# EAGLE design pic_can_switch (EAGLE 6.5.0)
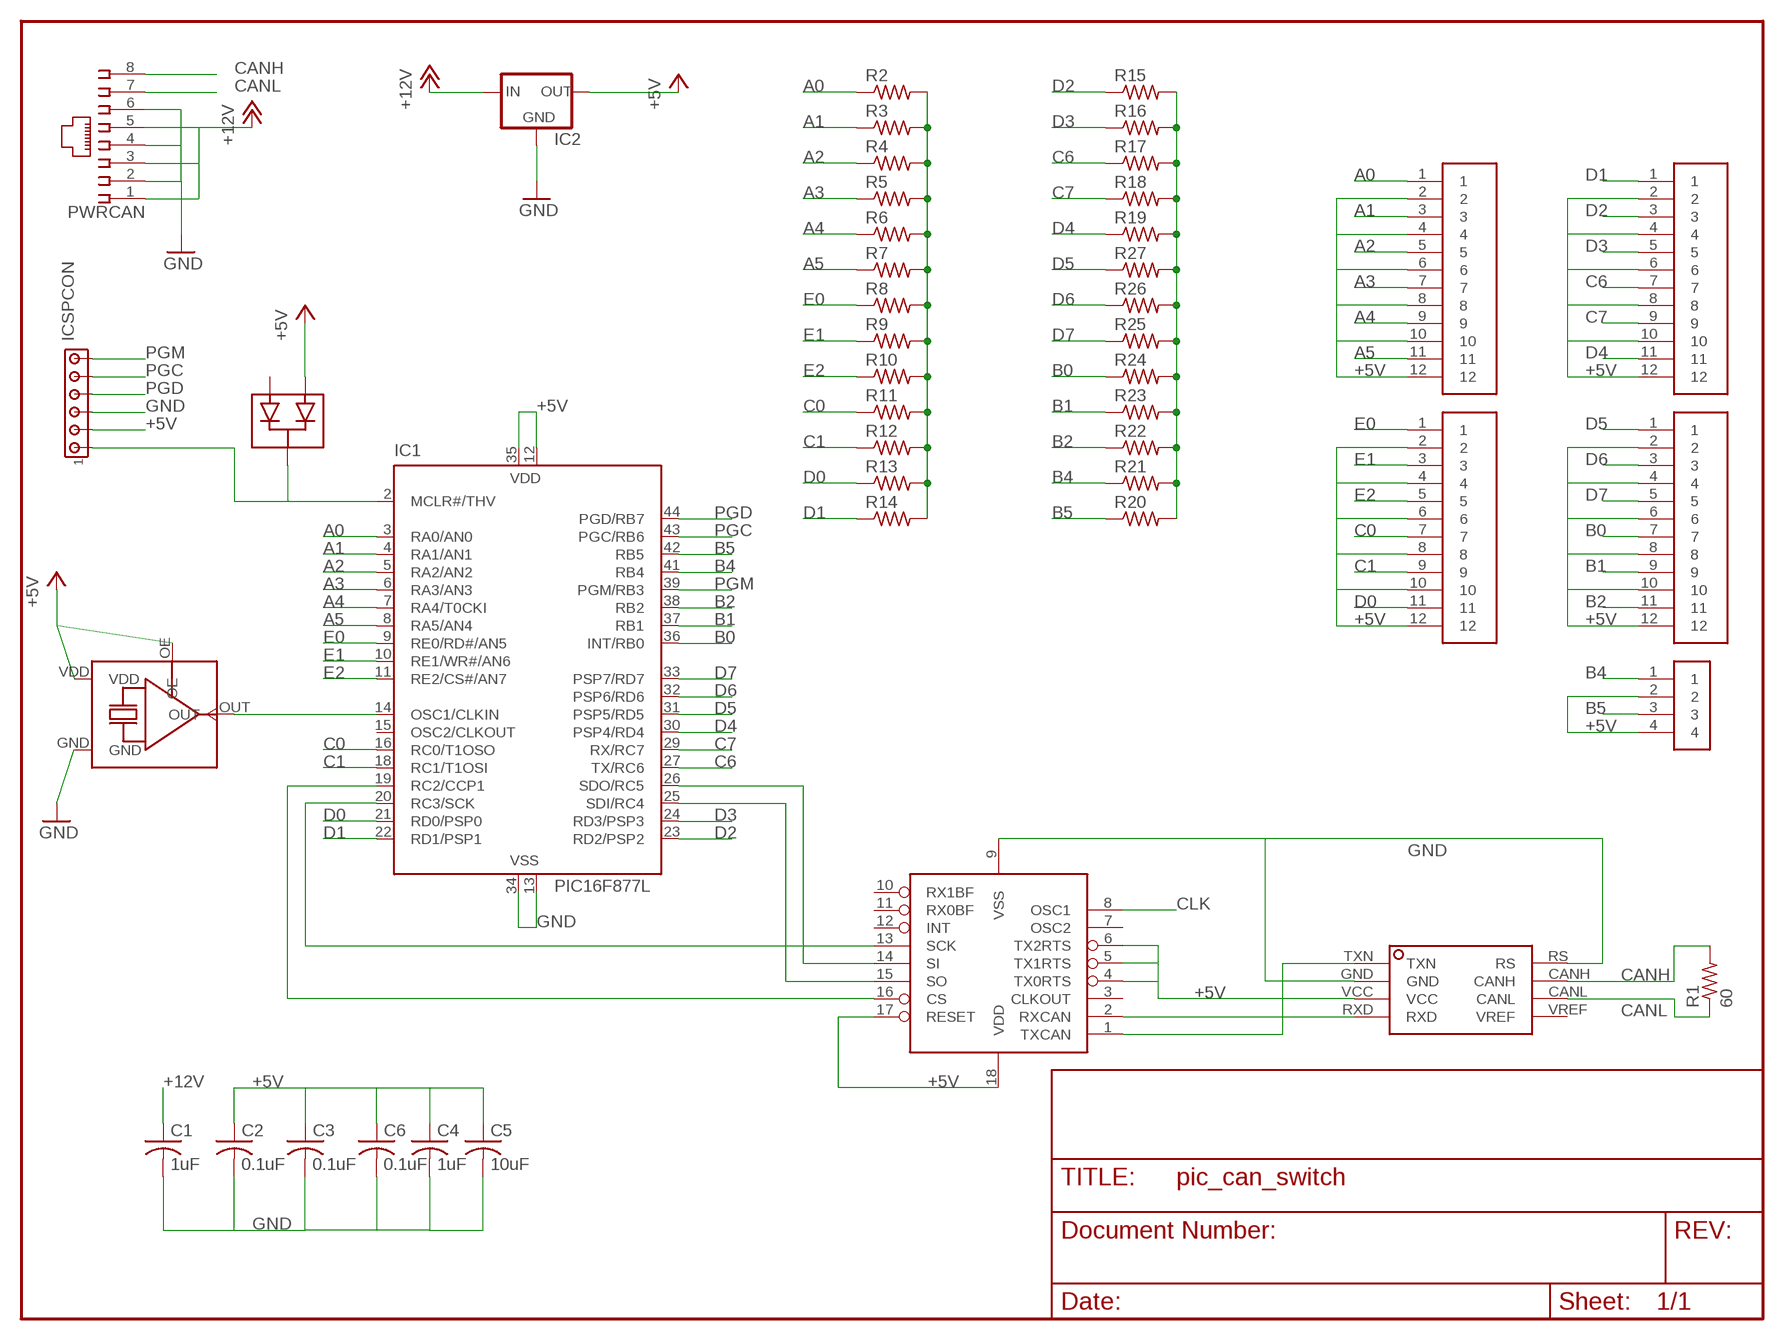
[diagram p0: schematic, sheet 1]

## Parts
C1  1uF  C-USC1206  [C1206]
C2  0.1uF  C-USC0805  [C0805]
C3  0.1uF  C-USC0805  [C0805]
C4  1uF  C-USC1206  [C1206]
C5  10uF  C-USC1210  [C1210]
C6  0.1uF  C-USC0805  [C0805]
IC1  PIC16F877L  [PLCC-44]
IC2  78XXL  [78XXL]
IC3  UC5350D  [SOIC8]
ICSPCON  MTA06-100  [10X06MTA]
MCP1  MCP2510-I/SO  [SO-18W]
PWRCAN  555764-1  [555764-1]
R1  60  R-US_R0805  [R0805]
R2  R-US_R0805  [R0805]
R3  R-US_R0805  [R0805]
R4  R-US_R0805  [R0805]
R5  R-US_R0805  [R0805]
R6  R-US_R0805  [R0805]
R7  R-US_R0805  [R0805]
R8  R-US_R0805  [R0805]
R9  R-US_R0805  [R0805]
R10  R-US_R0805  [R0805]
R11  R-US_R0805  [R0805]
R12  R-US_R0805  [R0805]
R13  R-US_R0805  [R0805]
R14  R-US_R0805  [R0805]
R15  R-US_R0805  [R0805]
R16  R-US_R0805  [R0805]
R17  R-US_R0805  [R0805]
R18  R-US_R0805  [R0805]
R19  R-US_R0805  [R0805]
R20  R-US_R0805  [R0805]
R21  R-US_R0805  [R0805]
R22  R-US_R0805  [R0805]
R23  R-US_R0805  [R0805]
R24  R-US_R0805  [R0805]
R25  R-US_R0805  [R0805]
R26  R-US_R0805  [R0805]
R27  R-US_R0805  [R0805]
TB1  MPT0.5/12-2.54  [MPT0.5/12-2.54]
TB2  MPT0.5/12-2.54  [MPT0.5/12-2.54]
TB3  MPT0.5/12-2.54  [MPT0.5/12-2.54]
TB4  MPT0.5/12-2.54  [MPT0.5/12-2.54]
TB5  MPT0.5/4-2.54"  [MPT0.5/4-2.54]
U$1  SG-615P  [SG-615]
U$2  BAV70_  [SOT-23]

## Nets
+5V: C2.1 C3.1 C4.1 C5.1 C6.1 IC1.12(VDD) IC1.35(VDD) IC2.OUT IC3.VCC ICSPCON.5 MCP1.4(TX0RTS) MCP1.5(TX1RTS) MCP1.6(TX2RTS) MCP1.17(RESET) MCP1.18(VDD) TB1.2 TB1.4 TB1.6 TB1.8 TB1.10 TB1.12 TB2.2 TB2.4 TB2.6 TB2.8 TB2.10 TB2.12 TB3.2 TB3.4 TB3.6 TB3.8 TB3.10 TB3.12 TB4.2 TB4.4 TB4.6 TB4.8 TB4.10 TB4.12 TB5.2 TB5.4 U$1.OE U$1.VDD U$2.1(A1)
+12V: C1.1 IC2.IN PWRCAN.1 PWRCAN.3 PWRCAN.5
A0: IC1.3(RA0/AN0) R2.1 TB1.1
A1: IC1.4(RA1/AN1) R3.1 TB1.3
A2: IC1.5(RA2/AN2) R4.1 TB1.5
A3: IC1.6(RA3/AN3) R5.1 TB1.7
A4: IC1.7(RA4/T0CKI) R6.1 TB1.9
A5: IC1.8(RA5/AN4) R7.1 TB1.11
B0: IC1.36(INT/RB0) R24.1 TB4.7
B1: IC1.37(RB1) R23.1 TB4.9
B2: IC1.38(RB2) R22.1 TB4.11
B4: IC1.41(RB4) R21.1 TB5.1
B5: IC1.42(RB5) R20.1 TB5.3
C0: IC1.16(RC0/T1OSO) R11.1 TB2.7
C1: IC1.18(RC1/T1OSI) R12.1 TB2.9
C6: IC1.27(TX/RC6) R17.1 TB3.7
C7: IC1.29(RX/RC7) R18.1 TB3.9
CANH: IC3.CANH PWRCAN.8 R1.2
CANL: IC3.CANL PWRCAN.7 R1.1
CLK: IC1.14(OSC1/CLKIN) MCP1.8(OSC1) U$1.OUT
D0: IC1.21(RD0/PSP0) R13.1 TB2.11
D1: IC1.22(RD1/PSP1) R14.1 TB3.1
D2: IC1.23(RD2/PSP2) R15.1 TB3.3
D3: IC1.24(RD3/PSP3) R16.1 TB3.5
D4: IC1.30(PSP4/RD4) R19.1 TB3.11
D5: IC1.31(PSP5/RD5) R27.1 TB4.1
D6: IC1.32(PSP6/RD6) R26.1 TB4.3
D7: IC1.33(PSP7/RD7) R25.1 TB4.5
E0: IC1.9(RE0/RD#/AN5) R8.1 TB2.1
E1: IC1.10(RE1/WR#/AN6) R9.1 TB2.3
E2: IC1.11(RE2/CS#/AN7) R10.1 TB2.5
GND: C1.2 C2.2 C3.2 C4.2 C5.2 C6.2 IC1.13(VSS) IC1.34(VSS) IC2.GND IC3.GND IC3.RS ICSPCON.4 MCP1.9(VSS) PWRCAN.2 PWRCAN.4 PWRCAN.6 R2.2 R3.2 R4.2 R5.2 R6.2 R7.2 R8.2 R9.2 R10.2 R11.2 R12.2 R13.2 R14.2 R15.2 R16.2 R17.2 R18.2 R19.2 R20.2 R21.2 R22.2 R23.2 R24.2 R25.2 R26.2 R27.2 U$1.GND
N$3: IC1.25(SDI/RC4) MCP1.15(SO)
N$4: IC1.26(SDO/RC5) MCP1.14(SI)
N$5: IC1.20(RC3/SCK) MCP1.13(SCK)
N$6: IC1.2(MCLR#/THV) ICSPCON.6 U$2.3(C)
N$7: IC3.TXN MCP1.1(TXCAN)
N$8: IC3.RXD MCP1.2(RXCAN)
N$12: IC1.19(RC2/CCP1) MCP1.16(CS)
PGC: IC1.43(PGC/RB6) ICSPCON.2
PGD: IC1.44(PGD/RB7) ICSPCON.3
PGM: IC1.39(PGM/RB3) ICSPCON.1
Unconnected: IC1.15(OSC2/CLKOUT) IC3.VREF MCP1.3(CLKOUT) MCP1.7(OSC2) MCP1.10(RX1BF) MCP1.11(RX0BF) MCP1.12(INT) U$2.2(A2)

## Library data of the parts
C1-C6 = rcl:C-US: CAPACITOR, American symbol
IC1 = microchip:PIC16F87*: MICROCONTROLLER
IC2 = v-reg:78XXL: VOLTAGE REGULATOR
IC3 = house:UC5350: CAN Tranceiver
ICSPCON = con-amp:MTA06-100: AMP CONNECTOR
MCP1 = microchip:MCP2510
PWRCAN = con-amp:555764-1: AMP CONNECTOR
R1-R27 = rcl:R-US_: RESISTOR, American symbol
TB1-TB4 = house:MPT0.5: Pheonix Contact Micro-Pitch Terminal Block
TB5 = house:MPT0.5/4-2.54: Pheonix Contact Micro-Pitch Terminal Block
U$1 = house:SG-615: Epson Electronics CMOS/TTL SMD Oscillator
U$2 = house:BAV70: Fairchild Semiconductor Small Signal, Dual, Common Cathode, SOT-23 Diode

## Board
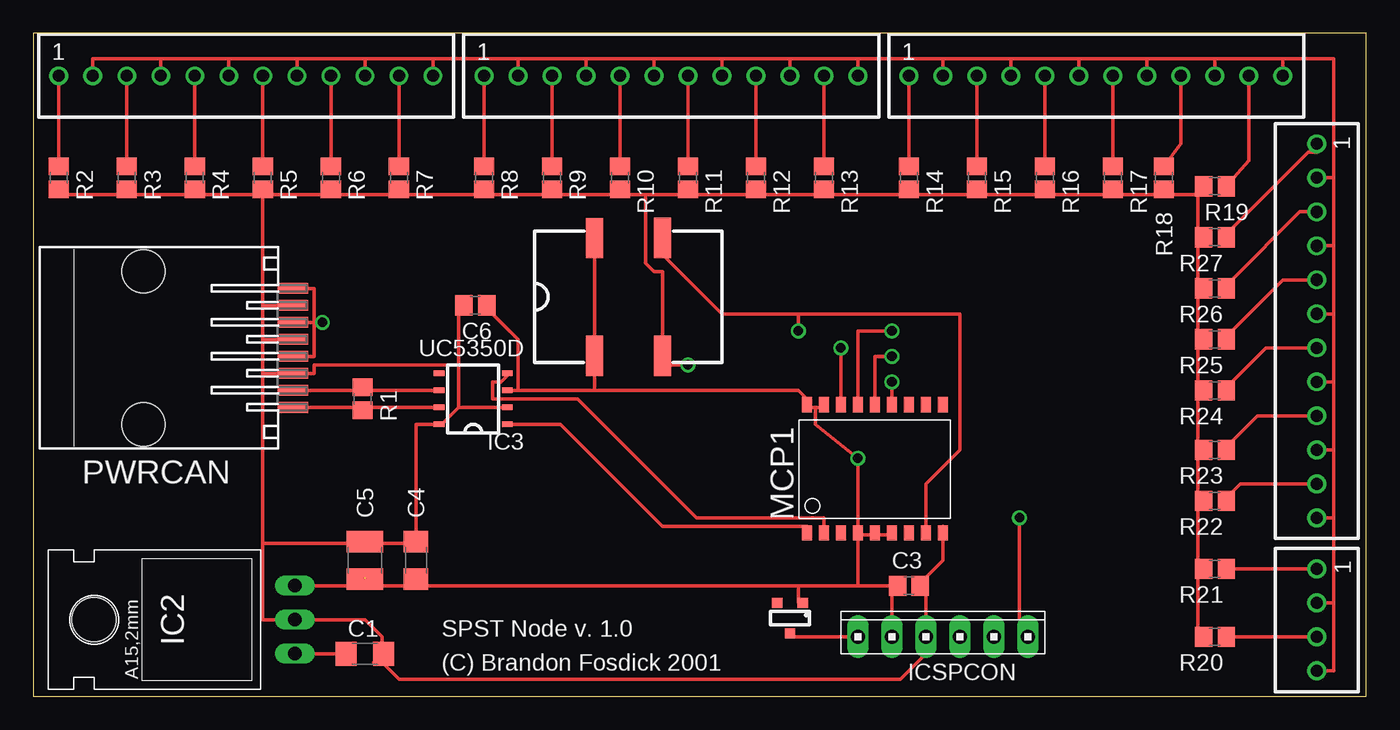
[diagram p1: board, top side]
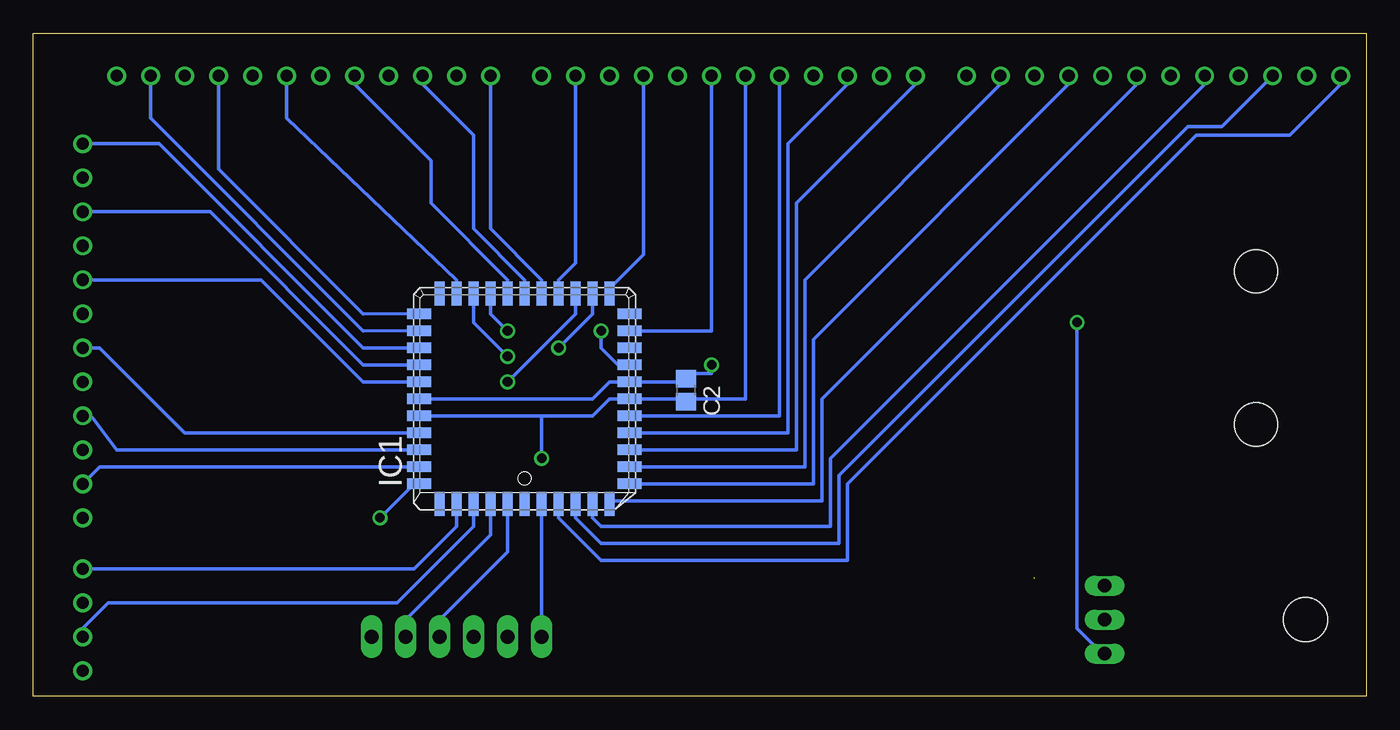
[diagram p2: board, bottom side, seen from below]

Size 99.55 x 49.55 mm. Coordinates in mm from the lower left corner, seen from the top.
Outline: 0,0 99.55,0 99.55,49.55 0,49.55 0,0
Copper layers (1*16): Top 0.035mm / dielectric 1.5mm / Bottom 0.035mm
Design rules "default": minimum track width 10mil, minimum drill 24mil, track to track 8mil, track to pad 8mil, pad to pad 8mil, via to via 8mil, smd to smd 8mil, copper to edge 40mil, drill to drill 8mil, minimum pad ring 10mil, minimum via ring 8mil, stop-mask expansion 0mil, vias tented up to drill 0mil, thermal gap 10mil

### Footprints (pad centres in the part's own frame; a part is rotated, then mirrored left to right if it is on the bottom)
C1206 = smd 1.6 x 1.8: 1 -1.4,0; 2 1.4,0
C0805 = smd 1.3 x 1.5: 1 -0.85,0; 2 0.85,0
C1210 = smd 1.6 x 2.7: 1 -1.4,0; 2 1.4,0
PLCC-44 = smd 1.8 x 0.76: 1 -7.86,0; 2 -7.86,-1.27; 3 -7.86,-2.54; 4 -7.86,-3.81; 5 -7.86,-5.08; 6 -7.86,-6.35; 18 7.86,-6.35; 19 7.86,-5.08; 20 7.86,-3.81; 21 7.86,-2.54; 22 7.86,-1.27; 23 7.86,0; 24 7.86,1.27; 25 7.86,2.54; 26 7.86,3.81; 27 7.86,5.08; 28 7.86,6.35; 40 -7.86,6.35; 41 -7.86,5.08; 42 -7.86,3.81; 43 -7.86,2.54; 44 -7.86,1.27 | smd 0.76 x 1.8: 7 -6.35,-7.86; 8 -5.08,-7.86; 9 -3.81,-7.86; 10 -2.54,-7.86; 11 -1.27,-7.86; 12 0,-7.86; 13 1.27,-7.86; 14 2.54,-7.86; 15 3.81,-7.86; 16 5.08,-7.86; 17 6.35,-7.86; 29 6.35,7.86; 30 5.08,7.86; 31 3.81,7.86; 32 2.54,7.86; 33 1.27,7.86; 34 0,7.86; 35 -1.27,7.86; 36 -2.54,7.86; 37 -3.81,7.86; 38 -5.08,7.86; 39 -6.35,7.86
78XXL = drill 1 long: GND 0,-3.81; IN -2.54,-3.81; OUT 2.54,-3.81 | hole 3.302: 0,11.176
SOIC8 = smd 0.813 x 0.406: CANH 2.54,1.27; CANL 2.54,0; GND -2.54,1.27; RS 2.54,2.54; RXD -2.54,-1.27; TXN -2.54,2.54; VCC -2.54,0; VREF 2.54,-1.27
10X06MTA = drill 1.067 long: 1 6.35,0; 2 3.81,0; 3 1.27,0; 4 -1.27,0; 5 -3.81,0; 6 -6.35,0
SO-18W = smd 0.762 x 1.143: 1 -5.08,-4.788; 2 -3.81,-4.788; 3 -2.54,-4.788; 4 -1.27,-4.788; 5 0,-4.788; 6 1.27,-4.788; 7 2.54,-4.788; 8 3.81,-4.788; 9 5.08,-4.788; 10 5.08,4.788; 11 3.81,4.788; 12 2.54,4.788; 13 1.27,4.788; 14 0,4.788; 15 -1.27,4.788; 16 -2.54,4.788; 17 -3.81,4.788; 18 -5.08,4.788
555764-1 = smd 0.813 x 2.286: 1 -4.445,10.033; 2 -3.175,10.033; 3 -1.905,10.033; 4 -0.635,10.033; 5 0.635,10.033; 6 1.905,10.033; 7 3.175,10.033; 8 4.445,10.033 | hole 3.251: -5.715,-1.143; 5.715,-1.143
R0805 = smd 1.3 x 1.5: 1 -0.85,0; 2 0.85,0
MPT0.5/12-2.54 = drill 0.9: 1 -12.7,0; 2 -10.16,0; 3 -7.62,0; 4 -5.08,0; 5 -2.54,0; 6 0,0; 7 2.54,0; 8 5.08,0; 9 7.62,0; 10 10.16,0; 11 12.7,0; 12 15.24,0
MPT0.5/4-2.54 = drill 0.9: 1 -5.08,0; 2 -2.54,0; 3 0,0; 4 2.54,0
SG-615 = smd 1.27 x 3: GND 2.54,-4.4; OE -2.54,-4.4; OUT 2.54,4.41; VDD -2.54,4.4
SOT-23 = smd 0.76 x 0.76: 1 -0.95,0; 2 0.95,0; 3 0,2.29

### Placement (x,y rotation side)
C1  24.76,3.2 0 top
C2  50.8,22.89 90 bottom
C3  65.4,8.28 0 top
C4  28.57,10.18 90 top
C5  24.76,10.18 90 top
C6  33.01,29.23 180 top
IC1  62.87,22.25 90 bottom
IC2  15.71,5.74 90 top
IC3  32.85,22.88 180 top
ICSPCON  67.94,4.47 0 top
MCP1  62.86,17.01 0 top
PWRCAN  9.36,26.06 270 top
R1  24.6,22.25 270 top
R2  1.9,38.76 270 top
R3  6.98,38.76 270 top
R4  12.06,38.76 270 top
R5  17.14,38.76 270 top
R6  22.22,38.76 270 top
R7  27.3,38.76 270 top
R8  33.65,38.76 270 top
R9  38.73,38.76 270 top
R10  43.81,38.76 270 top
R11  48.89,38.76 270 top
R12  53.97,38.76 270 top
R13  59.05,38.76 270 top
R14  65.4,38.76 270 top
R15  70.48,38.76 270 top
R16  75.56,38.76 270 top
R17  80.64,38.76 270 top
R18  84.45,38.76 270 top
R19  88.26,38.12 180 top
R20  88.26,4.47 180 top
R21  88.26,9.55 180 top
R22  88.26,14.63 180 top
R23  88.26,18.44 180 top
R24  88.26,22.88 180 top
R25  88.26,26.69 180 top
R26  88.26,30.5 180 top
R27  88.26,34.31 180 top
TB1  14.6,46.38 0 top
TB2  46.35,46.38 0 top
TB3  78.1,46.38 0 top
TB4  95.88,28.6 270 top
TB5  95.88,4.47 270 top
U$1  44.44,29.87 0 top
U$2  56.51,7.01 180 top

### Tracks (layer width: path | path; a pad name or v marks a point on that pad's centre or on a via)
+5V  (via drill 0.71)  (1 unrouted)
  Top 0.254: 51.43,47.65 TB2.8 | 51.43,47.65 56.51,47.65 | 56.51,47.65 56.51,47.01 TB2.10 | TB2.8 | 61.59,47.65 61.59,47.01 TB2.12 | 56.51,47.65 61.59,47.65 | 67.94,47.65 67.94,47.01 TB3.2 | 61.59,47.65 67.94,47.65 | 73.02,47.65 73.02,47.01 TB3.4 | 67.94,47.65 73.02,47.65 | 78.1,47.65 78.1,47.01 TB3.6 | 73.02,47.65 78.1,47.65 | 83.18,47.65 83.18,47.01 TB3.8 | 78.1,47.65 83.18,47.65 | 88.26,47.65 88.26,47.01 TB3.10 | 83.18,47.65 88.26,47.65 | 93.34,47.65 93.34,47.01 TB3.12 | 88.26,47.65 93.34,47.65 | 19.68,47.65 TB1.8 | 24.76,47.65 TB1.10 | 24.76,47.65 19.68,47.65 | 29.84,47.65 TB1.12 | 29.84,47.65 24.76,47.65 | 36.19,47.65 36.19,47.01 TB2.2 | 36.19,47.65 29.84,47.65 | 41.27,47.65 41.27,47.01 TB2.4 41.27,47.65 | 41.27,47.65 36.19,47.65 | 46.35,47.65 41.27,47.65 | 46.35,47.65 46.35,47.01 TB2.6 | 19.68,47.65 14.6,47.65 | 14.6,47.65 TB1.6 | 14.6,47.65 9.52,47.65 | 9.52,47.65 TB1.4 | 9.52,47.65 4.44,47.65 TB1.2 | 46.35,47.65 51.43,47.65 | 93.34,47.65 97.15,47.65 97.15,38.76 | 97.15,38.76 TB4.2 | 97.15,38.76 97.15,33.68 | 97.15,33.68 TB4.4 | 97.15,33.68 97.15,28.6 | 97.15,28.6 TB4.6 | 97.15,28.6 97.15,23.52 | 97.15,23.52 TB4.8 | 97.15,23.52 97.15,18.44 | 97.15,18.44 TB4.10 | 97.15,18.44 97.15,13.36 | 97.15,13.36 TB4.12 | 97.15,13.36 97.15,7.01 | 97.15,7.01 TB5.2 | 97.15,7.01 97.15,1.93 TB5.4 | 58.41,21.61 57.78,21.61 MCP1.18 57.78,22.25 57.14,22.88 41.9,22.88 | 58.41,21.61 59.05,21.61 MCP1.17 | 58.41,21.61 58.41,20.34 v61.59,17.8 MCP1.4 61.59,12.09 | 61.59,12.09 62.86,12.09 | 62.86,12.09 64.13,12.09 MCP1.6 | 62.86,12.09 MCP1.5 | 61.59,8.28 61.59,12.09 | 36.19,22.88 IC3.VCC | 41.9,22.88 36.19,22.88 | IC2.OUT 24.76,8.28 | 24.76,8.28 27.93,8.28 | 27.93,8.28 28.57,8.28 | 28.57,8.28 57.14,8.28
  Top 0.254: 57.14,8.28 61.59,8.28 | ICSPCON.5 64.13,7.64 C3.1 61.59,8.28 | 57.14,8.28 57.14,7.01 U$2.1 | C6.1 34.28,28.6 36.19,26.69 36.19,22.88 | 41.9,22.88 U$1.OE U$1.VDD | 27.93,8.28 C4.1 | 24.76,8.28 24.76,8.91 | 28.57,8.28 28.57,8.91
  Bottom 0.254: TB3.12 93.34,45.74 | 50.79,22.25 54.6,22.25 IC1.12 55.87,22.25 | 50.79,22.25 46.35,22.25 46.35,45.74 TB2.6 | 55.87,22.25 56.51,22.25 57.78,20.98 61.59,20.98 | 55.87,22.25 55.24,22.25 | 61.59,20.98 69.84,20.98 | 69.84,20.98 70.48,20.98 | v61.59,17.8 61.59,20.98 | 69.84,20.98 IC1.35 | 50.79,22.25 C2.1
+12V  (via drill 0.71)
  Top 0.254: 19.04,25.42 PWRCAN.5 20.95,25.42 20.95,27.96 | 20.95,27.96 20.95,30.5 PWRCAN.1 | v21.58,27.96 20.95,27.96 | 20.95,27.96 PWRCAN.3 | IC2.IN C1.1
  Bottom 0.254: v21.58,27.96 21.58,5.1 20.31,3.83 IC2.IN
A0
  Top 0.254: R2.1 TB1.1
  Bottom 0.254: IC1.3 60.32,13.36 57.14,10.18 38.73,10.18 38.73,15.9 12.69,41.93 5.71,41.93 1.9,45.74 TB1.1
A1
  Top 0.254: R3.1 TB1.3
  Bottom 0.254: IC1.4 59.05,13.36 57.14,11.45 39.36,11.45 39.36,16.53 13.33,42.57 10.79,42.57 TB1.3
A2
  Top 0.254: R4.1 TB1.5
  Bottom 0.254: IC1.5 57.78,13.36 57.14,12.72 40,12.72 40,17.8 12.06,45.74 TB1.5
A3
  Top 0.254: R5.1 TB1.7
  Bottom 0.254: TB1.7 17.14,45.74 40.63,22.25 40.63,14.63 56.51,14.63 IC1.6
A4
  Top 0.254: TB1.9 R6.1
  Bottom 0.254: TB1.9 22.22,45.74 41.27,26.69 41.27,15.9 54.6,15.9 IC1.7
A5
  Top 0.254: TB1.11 R7.1
  Bottom 0.254: IC1.8 54.6,17.17 41.9,17.17 41.9,31.14 27.3,45.74 TB1.11
B0
  Top 0.254: R24.1 89.53,23.52 92.07,26.06 TB4.7
  Bottom 0.254: IC1.36 71.11,19.71 88.26,19.71 94.61,26.06 TB4.7
B1
  Top 0.254: R23.1 89.53,19.07 91.43,20.98 TB4.9
  Bottom 0.254: IC1.37 71.11,18.44 93.34,18.44 95.24,20.98 TB4.9
B2
  Top 0.254: R22.1 89.53,15.26 90.16,15.9 TB4.11
  Bottom 0.254: IC1.38 71.11,17.17 94.61,17.17 TB4.11
B4
  Top 0.254: TB5.1 R21.1
  Bottom 0.254: IC1.41 67.94,12.72 71.11,9.55 TB5.1
B5
  Top 0.254: TB5.3 R20.1
  Bottom 0.254: IC1.42 66.67,12.72 72.38,7.01 93.97,7.01 95.88,5.1 TB5.3
C0
  Top 0.254: R11.1 48.89,45.74 TB2.7
  Bottom 0.254: IC1.16 54.6,27.33 48.89,27.33 48.89,45.74 TB2.7
C1
  Top 0.254: R12.1 53.97,45.74 TB2.9
  Bottom 0.254: IC1.18 56.51,30.5 53.97,33.04 53.97,45.74 TB2.9
C6
  Top 0.254: R17.1 80.64,45.74 TB3.7
  Bottom 0.254: IC1.27 67.94,31.14 80.64,43.2 80.64,45.74 TB3.7
C7
  Top 0.254: TB3.9 85.72,41.3 R18.1 | TB3.9
  Bottom 0.254: IC1.29 74.92,28.6 85.72,39.39 85.72,45.74 TB3.9
CANH
  Top 0.254: 30.47,21.61 IC3.CANH 24.76,21.61 R1.2 24.12,21.61 PWRCAN.8
CANL
  Top 0.254: 30.47,22.88 IC3.CANL 24.76,22.88 R1.1 24.12,22.88 PWRCAN.7
CLK  (via drill 0.71)
  Top 0.254: 57.14,28.6 69.21,28.6 69.21,18.44 66.67,15.9 MCP1.8 | 57.14,28.6 v57.14,27.33 | 57.14,28.6 51.43,28.6 46.98,33.04 U$1.OUT
  Bottom 0.254: 54.6,24.79 IC1.14 55.87,24.79 57.14,26.06 v57.14,27.33
D0
  Top 0.254: R13.1 59.05,45.74 TB2.11
  Bottom 0.254: IC1.21 60.32,31.14 59.05,32.41 59.05,45.74 TB2.11
D1
  Top 0.254: R14.1 65.4,45.74 TB3.1
  Bottom 0.254: IC1.22 61.59,31.14 65.4,34.95 65.4,45.74 TB3.1
D2
  Top 0.254: R15.1 70.48,45.74 TB3.3
  Bottom 0.254: IC1.23 62.86,31.14 66.67,34.95 66.67,41.93 70.48,45.74 TB3.3
D3
  Top 0.254: R16.1 75.56,45.74 TB3.5
  Bottom 0.254: IC1.24 64.13,31.14 69.84,36.85 69.84,40.03 75.56,45.74 TB3.5
D4
  Top 0.254: TB3.11 90.8,40.03 R19.1 | TB3.11
  Bottom 0.254: TB3.11 90.8,43.2 74.92,27.33 IC1.30 | TB3.11
D5
  Top 0.254: R27.1 89.53,34.95 95.24,40.66 95.88,40.66 TB4.1
  Bottom 0.254: IC1.31 71.11,26.06 74.92,26.06 90.16,41.3 TB4.1
D6
  Top 0.254: R26.1 89.53,31.14 94.61,36.22 TB4.3
  Bottom 0.254: TB4.3 86.35,36.22 74.92,24.79 71.11,24.79 IC1.32
D7
  Top 0.254: R25.1 89.53,27.33 93.34,31.14 TB4.5
  Bottom 0.254: IC1.33 71.11,23.52 74.92,23.52 82.54,31.14 TB4.5
E0
  Top 0.254: R8.1 33.65,45.74 TB2.1
  Bottom 0.254: IC1.9 54.6,18.44 42.54,18.44 42.54,36.85 33.65,45.74 TB2.1
E1
  Top 0.254: R9.1 38.73,45.74 TB2.3
  Bottom 0.254: IC1.10 54.6,19.71 43.17,19.71 43.17,41.3 38.73,45.74 TB2.3
E2
  Top 0.254: R10.1 43.81,45.74 TB2.5
  Bottom 0.254: 43.81,45.74 43.81,20.98 54.6,20.98 IC1.11 | 43.81,45.74 TB2.5 43.81,45.74
GND  (via drill 0.71)
  Top 0.254: 31.74,21.61 30.47,20.34 IC3.RS 28.57,20.34 C4.2 27.93,11.45 26.03,11.45 C5.2 | 31.74,21.61 IC3.GND 35.55,21.61 | 31.74,24.79 31.74,21.61 | 31.74,24.79 20.95,24.79 20.95,24.15 PWRCAN.6 17.14,24.15 | 67.94,12.72 MCP1.9 67.94,10.18 66.67,8.91 C3.2 66.67,7.64 ICSPCON.4 66.67,3.2 64.76,1.29 27.3,1.29 26.03,2.56 C1.2 | C1.2 25.39,2.56 | 19.68,5.74 IC2.GND | 19.68,5.74 24.76,5.74 26.03,4.47 26.03,3.83 C1.2 | 31.74,24.79 31.74,29.23 C6.2 | 19.68,5.74 17.14,5.74 17.14,11.45 | v48.89,24.79 46.98,24.79 U$1.GND 46.98,31.77 46.35,31.77 45.71,32.41 45.71,37.49 | 86.99,37.49 85.08,37.49 R18.2 83.81,37.49 81.27,37.49 R17.2 80,37.49 76.19,37.49 R16.2 74.92,37.49 71.11,37.49 R15.2 69.84,37.49 66.03,37.49 R14.2 64.76,37.49 59.68,37.49 R13.2 58.41,37.49 54.6,37.49 R12.2 53.33,37.49 49.52,37.49 R11.2 48.25,37.49 45.71,37.49 | R20.2 86.99,5.1 86.99,8.91 R21.2 86.99,10.18 86.99,13.99 R22.2 86.99,15.26 86.99,17.8 R23.2 86.99,19.07 86.99,22.25 R24.2 86.99,23.52 86.99,26.06 R25.2 86.99,27.33 86.99,29.87 R26.2 86.99,31.14 86.99,33.68 R27.2 86.99,34.95 86.99,37.49 | 86.99,37.49 R19.2 | R2.2 2.53,37.49 6.34,37.49 R3.2 7.61,37.49 11.42,37.49 | R5.2 16.5,37.49 12.69,37.49 R4.2 11.42,37.49 | R5.2 17.77,37.49 21.58,37.49 R6.2 22.85,37.49 26.66,37.49 R7.2 27.93,37.49 33.01,37.49 R8.2 34.28,37.49 38.09,37.49 R9.2 39.36,37.49 43.17,37.49 R10.2 44.44,37.49 45.71,37.49 | 17.14,24.15 17.14,26.69 | 17.14,26.69 PWRCAN.4 | 17.14,26.69 17.14,29.23 | 17.14,29.23 PWRCAN.2 | 11.42,37.49 12.06,37.49 | 17.14,11.45 17.14,24.15 | 17.14,29.23 R5.2 | 24.76,11.45 17.14,11.45
  Bottom 0.254: 69.84,22.25 57.78,22.25 56.51,23.52 55.24,23.52 IC1.13 54.6,23.52 51.43,23.52 C2.2 50.79,24.15 48.89,24.15 v48.89,24.79 | 69.84,22.25 70.48,22.25 | 69.84,22.25 IC1.34
N$3  (via drill 0.71)
  Top 0.254: v64.13,27.33 61.59,27.33 MCP1.15
  Bottom 0.254: v64.13,27.33 65.4,28.6 IC1.25
N$4  (via drill 0.71)
  Top 0.254: v64.13,25.42 62.86,25.42 MCP1.14
  Bottom 0.254: v64.13,25.42 66.67,27.96 IC1.26
N$5  (via drill 0.71)
  Top 0.254: MCP1.13 v64.13,23.52
  Bottom 0.254: v64.13,23.52 59.05,28.6 IC1.20
N$6
  Top 0.254: U$2.3 56.51,4.47 ICSPCON.6
  Bottom 0.254: ICSPCON.6 IC1.2
N$7
  Top 0.254: IC3.TXN 39.36,20.34 46.98,12.72 57.78,12.72 MCP1.1
N$8
  Top 0.254: IC3.RXD 35.55,24.15 34.92,23.52 34.28,23.52 34.28,22.25 40.63,22.25 49.52,13.36 59.05,13.36 MCP1.2
N$12  (via drill 0.71)
  Top 0.254: MCP1.16 v60.32,26.06
  Bottom 0.254: v60.32,26.06 57.78,28.6 IC1.19
PGC
  Bottom 0.254: IC1.43 65.4,12.09 71.75,5.74 ICSPCON.2
PGD
  Bottom 0.254: IC1.44 64.13,10.82 69.21,5.74 ICSPCON.3
PGM  (via drill 0.71)
  Top 0.254: v73.65,13.36 73.65,5.74 ICSPCON.1
  Bottom 0.254: v73.65,13.36 71.11,15.9 IC1.39

### Text on the board
Top: 1 Top
Bottom: 16 Bottom
Pads: 17 Pads
Vias: 18 Vias
Dimension: 20 Dimension
tPlace: 21 tPlace
tNames: 25 tName | SPST Node v. 1.0 | (C) Brandon Fosdick 2001
tStop: 29 tStop
bStop: 30 bStop